# Altium schematic sheet Sheet1.SchDoc
size A4
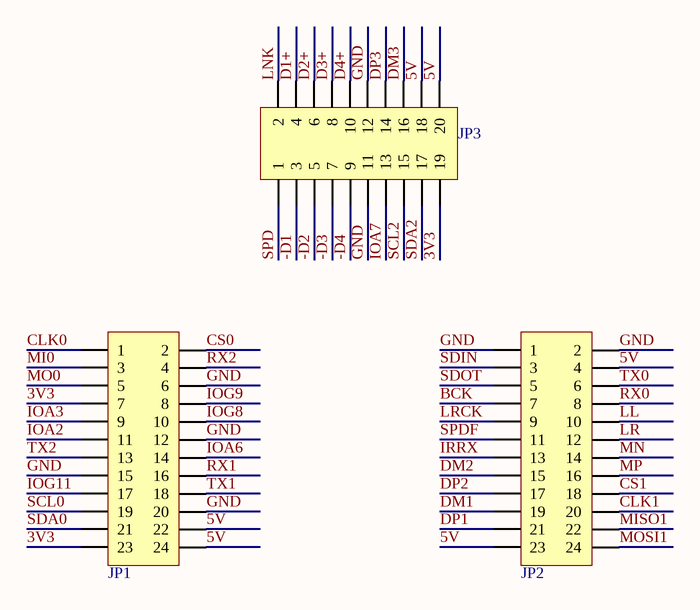
[diagram p0: Sheet1.SchDoc]

## Parts
JP1  Header 2X11  [HDR2X12]  (value not drawn)
JP2  Header 2X11  [HDR2X12]  (value not drawn)
JP3  Header 2X10  [HDR2X10]  (value not drawn)

## Nets
3V3: JP1.7 JP1.23 JP3.19
5V: JP1.22 JP1.24 JP2.4 JP2.23 JP3.18 JP3.20
-D1: JP3.3
-D2: JP3.5
-D3: JP3.7
-D4: JP3.9
BCK: JP2.7
CLK0: JP1.1
CLK1: JP2.20
CS0: JP1.2
CS1: JP2.18
D1+: JP3.4
D2+: JP3.6
D3+: JP3.8
D4+: JP3.10
DM1: JP2.19
DM2: JP2.15
DM3: JP3.16
DP1: JP2.21
DP2: JP2.17
DP3: JP3.14
GND: JP1.6 JP1.12 JP1.15 JP1.20 JP2.1 JP2.2 JP3.11 JP3.12
IOA2: JP1.11
IOA3: JP1.9
IOA6: JP1.14
IOA7: JP3.13
IOG8: JP1.10
IOG9: JP1.8
IOG11: JP1.17
IRRX: JP2.13
LL: JP2.10
LNK: JP3.2
LR: JP2.12
LRCK: JP2.9
MI0: JP1.3
MISO1: JP2.22
MN: JP2.14
MO0: JP1.5
MOSI1: JP2.24
MP: JP2.16
RX0: JP2.8
RX1: JP1.16
RX2: JP1.4
SCL0: JP1.19
SCL2: JP3.15
SDA0: JP1.21
SDA2: JP3.17
SDIN: JP2.3
SDOT: JP2.5
SPD: JP3.1
SPDF: JP2.11
TX0: JP2.6
TX1: JP1.18
TX2: JP1.13

## Library data of the parts
JP1 JP2 = Header 12X2: 12*2P接插件; 版权归属: 源创客; BOM名称: 12*2P接插件; 学习资源: www.ooocke.com
JP3 = Header 10X2: 10*2P接插件; 版权归属: 源创客; BOM名称: 10*2P接插件; 学习资源: www.ooocke.com